# EAGLE design circuit (EAGLE 6.6.0)
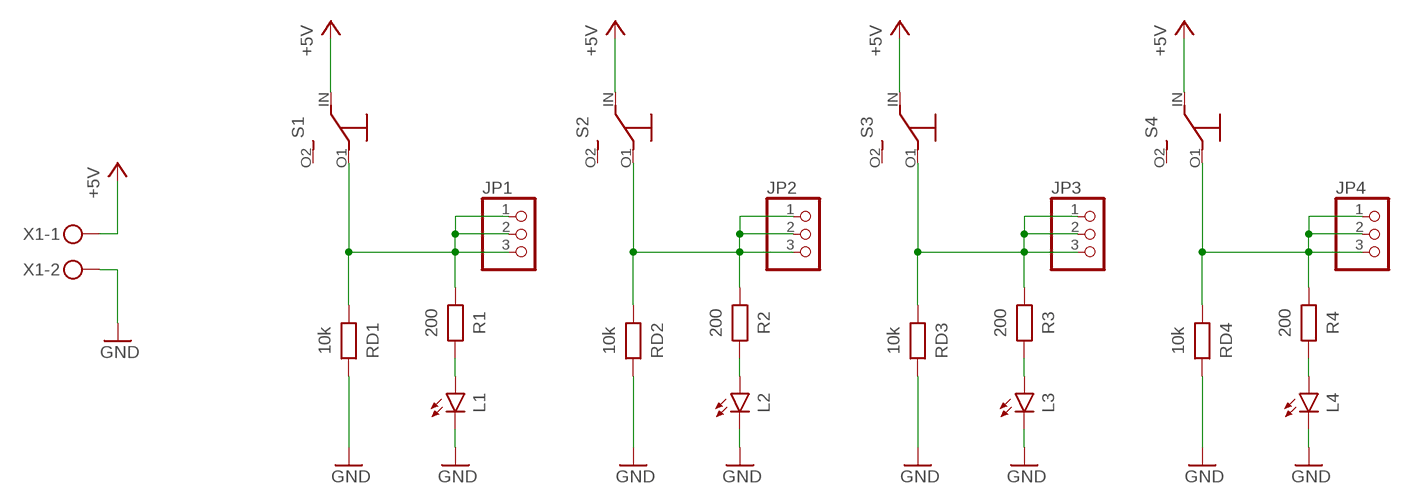
[diagram p0: schematic, sheet 1]

## Parts
JP1  PINHD-1X3  [1X03]
JP2  PINHD-1X3  [1X03]
JP3  PINHD-1X3  [1X03]
JP4  PINHD-1X3  [1X03]
L1  LED-3MM  [LED_3MM]
L2  LED-3MM  [LED_3MM]
L3  LED-3MM  [LED_3MM]
L4  LED-3MM  [LED_3MM]
R1  200  RESISTOR-10MM  [R_THT_4]
R2  200  RESISTOR-10MM  [R_THT_4]
R3  200  RESISTOR-10MM  [R_THT_4]
R4  200  RESISTOR-10MM  [R_THT_4]
RD1  10k  RESISTOR-10MM  [R_THT_4]
RD2  10k  RESISTOR-10MM  [R_THT_4]
RD3  10k  RESISTOR-10MM  [R_THT_4]
RD4  10k  RESISTOR-10MM  [R_THT_4]
S1  SCHALTER_UM-KIPP  [SCHALTER_KIPP_UM]
S2  SCHALTER_UM-KIPP  [SCHALTER_KIPP_UM]
S3  SCHALTER_UM-KIPP  [SCHALTER_KIPP_UM]
S4  SCHALTER_UM-KIPP  [SCHALTER_KIPP_UM]
X1  STECKER_SPG_2  [STECKER_SPG_2]

## Nets
+5V: S1.IN S2.IN S3.IN S4.IN X1.1
GND: L1.K(C) L2.K(C) L3.K(C) L4.K(C) RD1.1 RD2.1 RD3.1 RD4.1 X1.2
N$1: JP2.1 JP2.2 JP2.3 R2.2 RD2.2 S2.O1
N$2: L2.A R2.1
N$3: JP3.1 JP3.2 JP3.3 R3.2 RD3.2 S3.O1
N$4: L3.A R3.1
N$5: JP1.1 JP1.2 JP1.3 R1.2 RD1.2 S1.O1
N$6: JP4.1 JP4.2 JP4.3 R4.2 RD4.2 S4.O1
N$7: L4.A R4.1
N$10: L1.A R1.1
Unconnected: S1.O2 S2.O2 S3.O2 S4.O2

## Library data of the parts
JP1-JP4 = pinhead:PINHD-1X3: PIN HEADER
L1-L4 = robo_ag:LED: Led Reichelt: LA E67B Variante: PLCC4 560-1400mcd 2,2V; 50mA Gelb-Orange SMD Reichelt: LA E67F Variante: PLCC4_REV 560mcd 2,65V; 50mA Orange SMD
R1-R4 RD1-RD4 = robo_ag:RESISTOR: Widerstand Reichelt: METALL x,xx[k]
S1-S4 = robo_ag:SCHALTER_UM: Umschalter Reichelt: KIPP 1A11 Variante: KIPP Kippschalter mit Lötösen 5A bei 120V Reichelt: SS SMD402 Variante: SMD 24V 0,2A
X1 = robo_ag:STECKER_SPG_2: Anschlussklemme Reichelt:AKL 101-02 Nicht Anreihbar Reichelt:AKL 057-02 Anreihbar

## Board
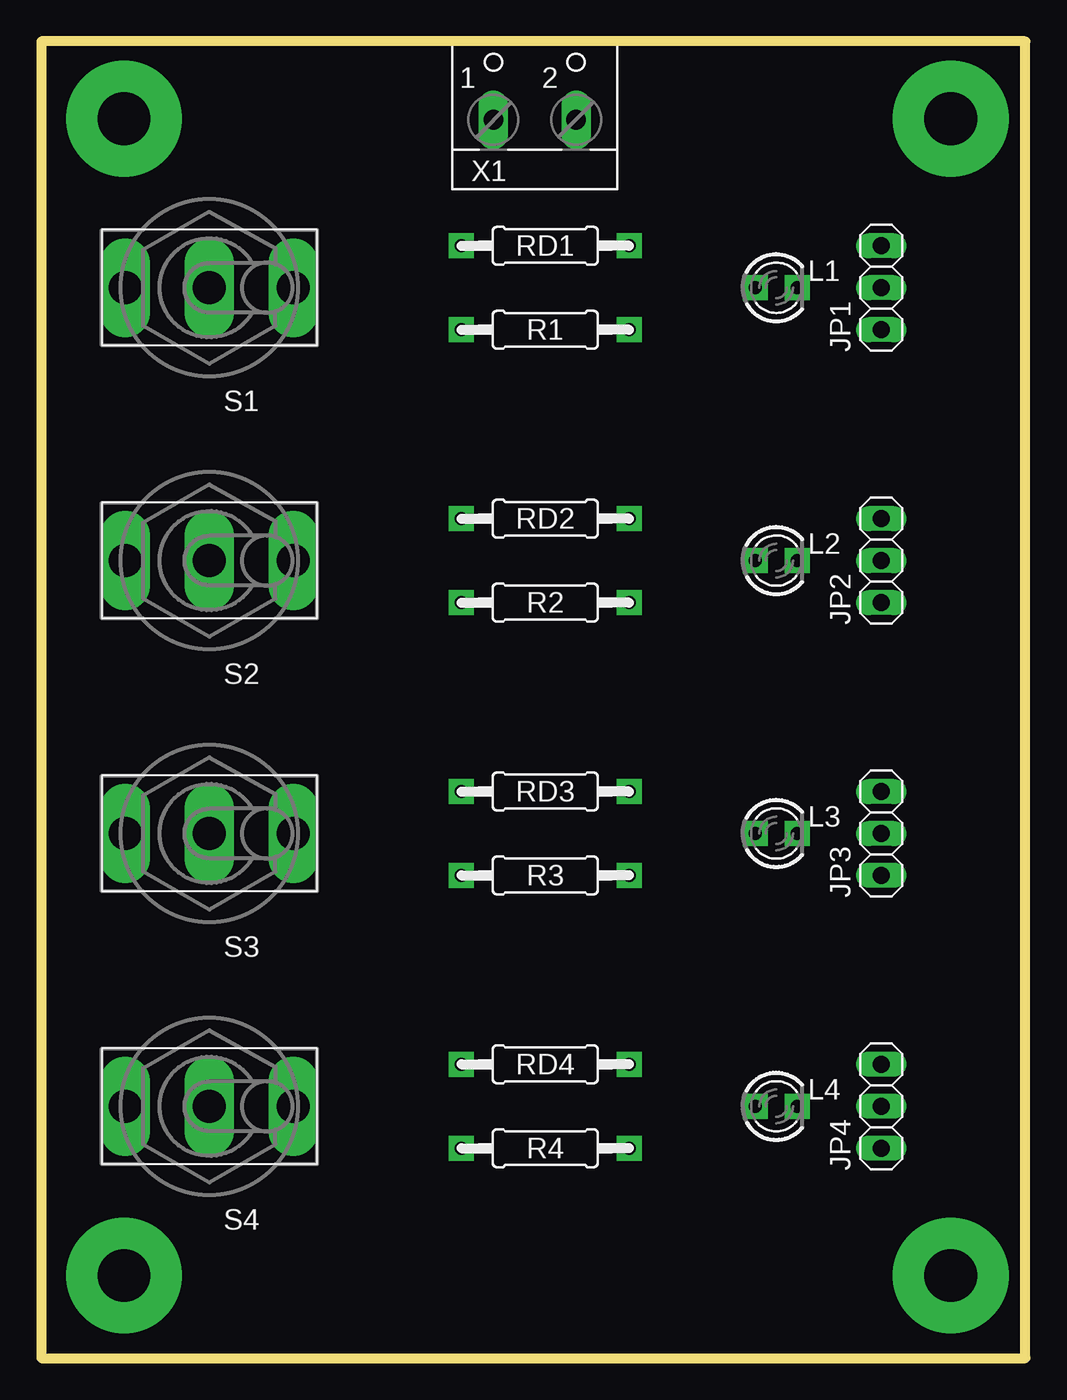
[diagram p1: board, top side]
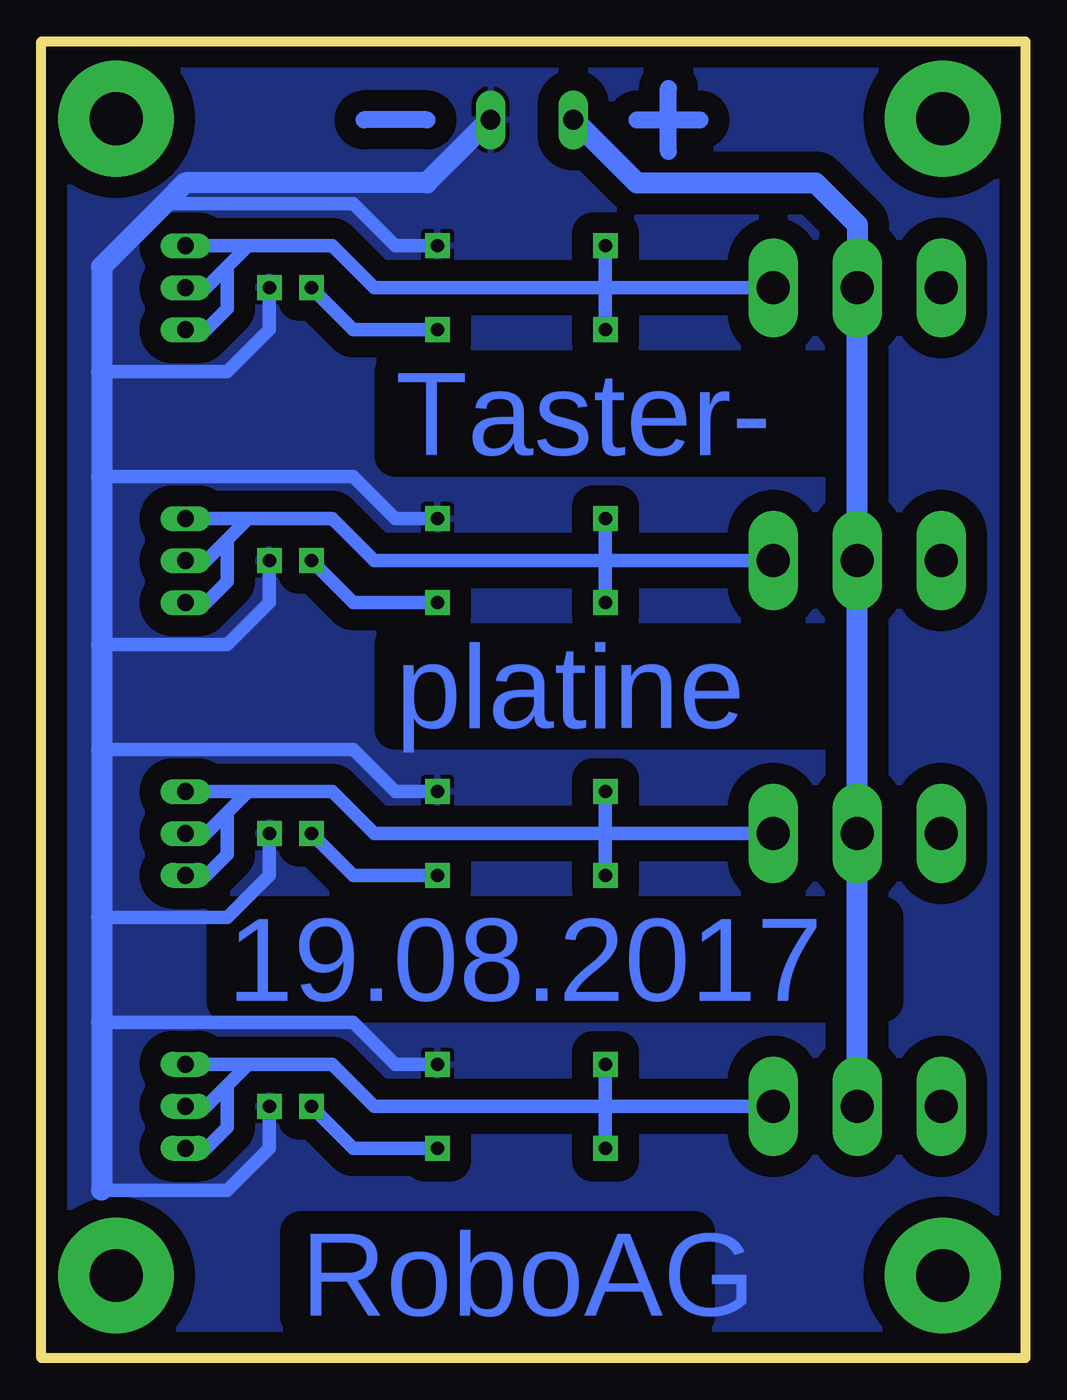
[diagram p2: board, bottom side, seen from below]

Size 59.52 x 79.68 mm. Coordinates in mm from the lower left corner, seen from the top.
Outline: 0,0 59.52,0 59.52,79.68 0,79.68 0,0
Copper layers (1*16): Top 0.035mm / dielectric 1.5mm / Bottom 0.035mm
Design rules "default": minimum track width 10mil, minimum drill 24mil, track to track 8mil, track to pad 8mil, pad to pad 8mil, via to via 8mil, smd to smd 8mil, copper to edge 40mil, drill to drill 8mil, minimum pad ring 10mil, minimum via ring 8mil, stop-mask expansion 4mil, vias tented up to drill 0mil, thermal gap 10mil

### Footprints (pad centres in the part's own frame; a part is rotated, then mirrored left to right if it is on the bottom)
1X03 = drill 1.016 long: 1 -2.54,0; 2 0,0; 3 2.54,0
LED_3MM = drill 0.8 pad 1.5 square: A -1.27,0; K 1.27,0
R_THT_4 = drill 0.8 pad 1.5 square: 1 -5.08,0; 2 5.08,0
SCHALTER_KIPP_UM = drill 2 pad 3 long: IN 0,0; O1 -5.08,0; O2 5.08,0
STECKER_SPG_2 = drill 1.194 long: 1 -2.5,-1.27; 2 2.5,-1.27

### Placement (x,y rotation side)
JP1  50.8,64.77 90 top
JP2  50.8,48.26 90 top
JP3  50.8,31.75 90 top
JP4  50.8,15.24 90 top
L1  44.45,64.77 0 top
L2  44.45,48.26 0 top
L3  44.45,31.75 0 top
L4  44.45,15.24 0 top
R1  30.48,62.23 180 top
R2  30.48,45.72 180 top
R3  30.48,29.21 180 top
R4  30.48,12.7 180 top
RD1  30.48,67.31 180 top
RD2  30.48,50.8 180 top
RD3  30.48,34.29 180 top
RD4  30.48,17.78 180 top
S1  10.16,64.77 180 top
S2  10.16,48.26 180 top
S3  10.16,31.75 180 top
S4  10.16,15.24 180 top
X1  29.84,76.2 0 top

### Tracks (layer width: path | path; a pad name or v marks a point on that pad's centre or on a via)
+5V
  Bottom 1.016: X1.1 27.3,74.93
  Bottom 1.27: S4.IN S3.IN S2.IN S1.IN 10.16,68.58 12.7,71.12 23.5,71.12 27.3,74.93
GND
  Bottom 0.813: RD1.1 38.1,67.31 40.64,69.85 52.07,69.85 | RD2.1 38.1,50.8 40.64,53.34 55.88,53.34 | RD3.1 38.1,34.29 40.64,36.83 55.88,36.83 | RD4.1 38.1,17.78 40.64,20.32 55.88,20.32 | L1.K 45.72,62.23 48.26,59.69 55.88,59.69 | L2.K 45.72,45.72 48.26,43.18 55.88,43.18 | L3.K 45.72,29.21 48.26,26.67 55.88,26.67 | L4.K 45.72,12.7 48.26,10.16 55.88,10.16
  Bottom 1.016: X1.2 32.38,74.93
  Bottom 1.27: 55.88,10.16 55.88,20.32 55.88,26.67 55.88,36.83 55.88,43.18 55.88,53.34 55.88,59.69 55.88,66.04 52.07,69.85 50.8,71.12 36.2,71.12 32.38,74.93
  pour Bottom (isolate 1.27): 0,80.01 59.85,80.01 59.85,0 0,0
N$1
  Bottom 0.813: S2.O1 25.4,48.26 | 25.4,48.26 39.37,48.26 41.91,50.8 46.99,50.8 | RD2.2 25.4,48.26 | R2.2 25.4,48.26 | 46.99,50.8 48.26,49.53 | 48.26,49.53 49.53,48.26 JP2.2 | JP2.3 46.99,50.8 | JP2.1 49.53,45.72 48.26,46.99 48.26,49.53
N$2
  Bottom 0.813: R2.1 40.64,45.72 L2.A
N$3
  Bottom 0.813: S3.O1 25.4,31.75 | 25.4,31.75 39.37,31.75 41.91,34.29 46.99,34.29 | RD3.2 25.4,31.75 | R3.2 25.4,31.75 | 46.99,34.29 48.26,33.02 | 48.26,33.02 49.53,31.75 JP3.2 | JP3.3 46.99,34.29 | JP3.1 49.53,29.21 48.26,30.48 48.26,33.02
N$4
  Bottom 0.813: R3.1 40.64,29.21 L3.A
N$5
  Bottom 0.813: S1.O1 25.4,64.77 | 25.4,64.77 39.37,64.77 41.91,67.31 46.99,67.31 | RD1.2 25.4,64.77 | R1.2 25.4,64.77 | 46.99,67.31 48.26,66.04 | 48.26,66.04 49.53,64.77 JP1.2 | JP1.3 46.99,67.31 | JP1.1 49.53,62.23 48.26,63.5 48.26,66.04
N$6
  Bottom 0.813: S4.O1 25.4,15.24 | 25.4,15.24 39.37,15.24 41.91,17.78 46.99,17.78 | RD4.2 25.4,15.24 | R4.2 25.4,15.24 | 46.99,17.78 48.26,16.51 | 48.26,16.51 49.53,15.24 JP4.2 | JP4.3 46.99,17.78 | JP4.1 49.53,12.7 48.26,13.97 48.26,16.51
N$7
  Bottom 0.813: R4.1 40.64,12.7 L4.A
N$8
  Bottom 1.016: 36.2,74.93 40.01,74.93
N$9
  Bottom 1.016: 23.5,74.93 19.68,74.93
N$10
  Bottom 0.813: R1.1 40.64,62.23 L1.A
N$11
  Bottom 1.016: 21.59,73.03 21.59,76.83
N$27  (via drill 3.2 pad 7)
  other vias: 5,5
N$28  (via drill 3.2 pad 7)
  other vias: 55,5
N$29  (via drill 3.2 pad 7)
  other vias: 55,75
N$30  (via drill 3.2 pad 7)
  other vias: 5,75

### Text on the board
Bottom: Taster- | platine | 19.08.2017 | RoboAG